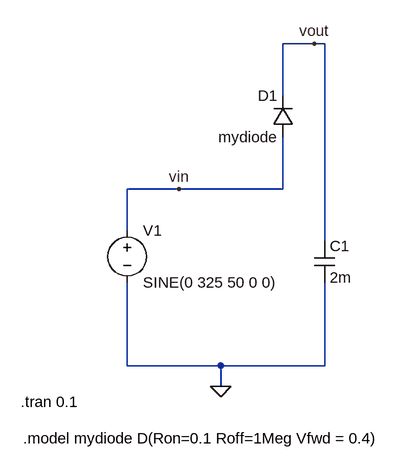
[diagram p0: schematic D_MOS_Parallel.asc]
D_MOS_Parallel.asc, the LTspice schematic file:
Version 4
SHEET 1 880 680
WIRE 336 -160 288 -160
WIRE 352 -160 336 -160
WIRE 288 -80 288 -160
WIRE 128 64 48 64
WIRE 288 64 288 -16
WIRE 288 64 128 64
WIRE 48 128 48 64
WIRE 352 144 352 -160
WIRE 48 336 48 208
WIRE 192 336 48 336
WIRE 352 336 352 208
WIRE 352 336 192 336
WIRE 192 368 192 336
FLAG 192 368 0
FLAG 336 -160 vout
FLAG 128 64 vin
SYMBOL voltage 48 112 R0
WINDOW 123 0 0 Left 0
WINDOW 39 0 0 Left 0
SYMATTR InstName V1
SYMATTR Value SINE(0 325 50 0 0)
SYMBOL cap 336 144 R0
SYMATTR InstName C1
SYMATTR Value 2m
SYMBOL diode 304 -16 R180
WINDOW 0 24 64 Left 2
WINDOW 3 24 0 Left 2
SYMATTR InstName D1
SYMATTR Value mydiode
TEXT -116 392 Left 2 !.tran 0.1
TEXT -112 448 Left 2 !.model mydiode D(Ron=0.1 Roff=1Meg Vfwd = 0.4)

The netlist it stands for:
* D_MOS_Parallel.asc
V1 vin 0 SINE(0 325 50 0 0)
C1 vout 0 2m
D1 vin vout mydiode
.model D D
.lib standard.dio
.tran 0.1
.model mydiode D(Ron=0.1 Roff=1Meg Vfwd = 0.4)
.backanno
.end

* Results of the author's LTspice run, read from the files saved beside the schematic
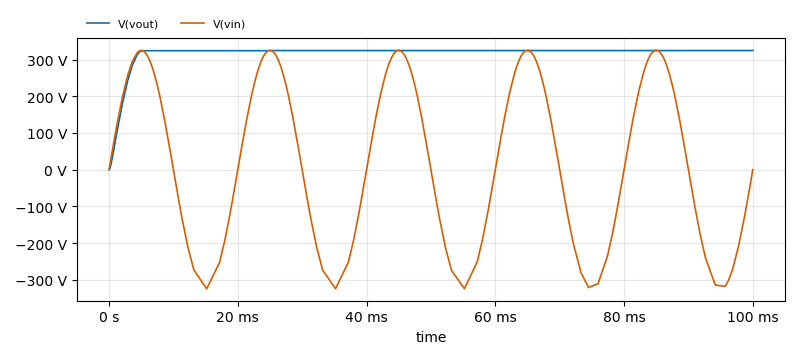
[diagram p1: Transient Analysis of D_MOS_Parallel.asc, plotted from the saved traces]
* Transient Analysis, 1 run:
*   V(vout): min 0 V, max 324.6 V, average 317.8 V, rms 320 V, last 324.5 V
*   V(vin): min -324.3 V, max 325 V, average 1.708 V, rms 228.3 V, last 0 V